# EAGLE board master-v1.1 (EAGLE 6.2)
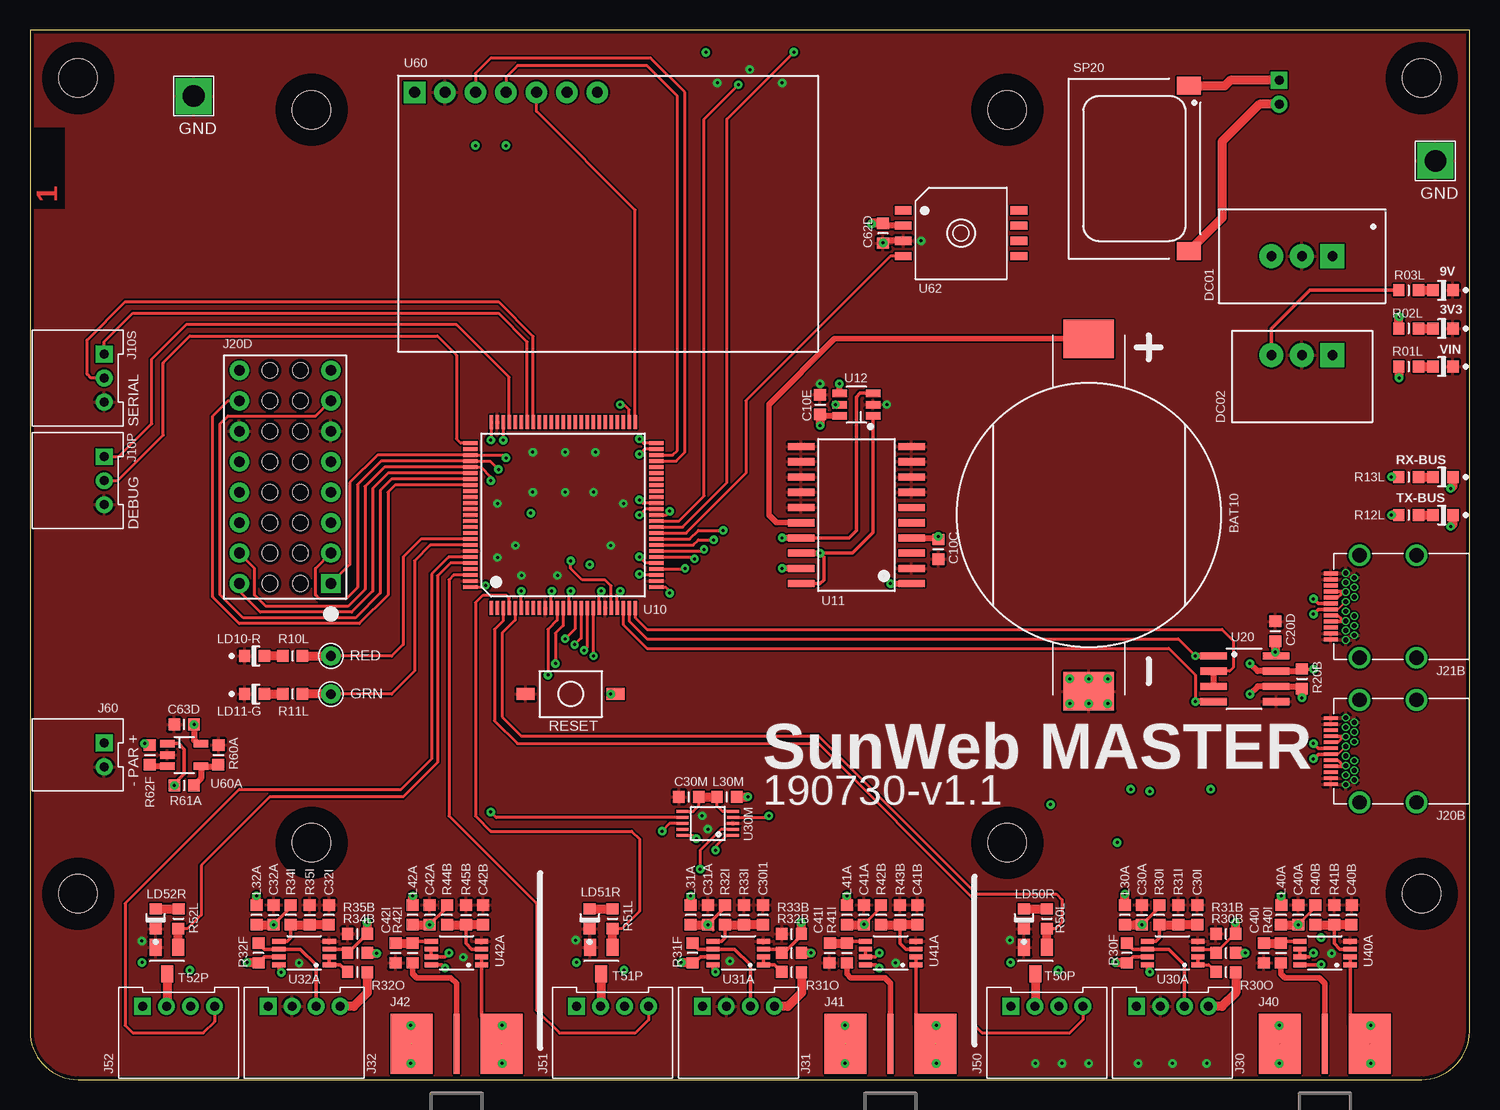
[diagram p7: board, top side]
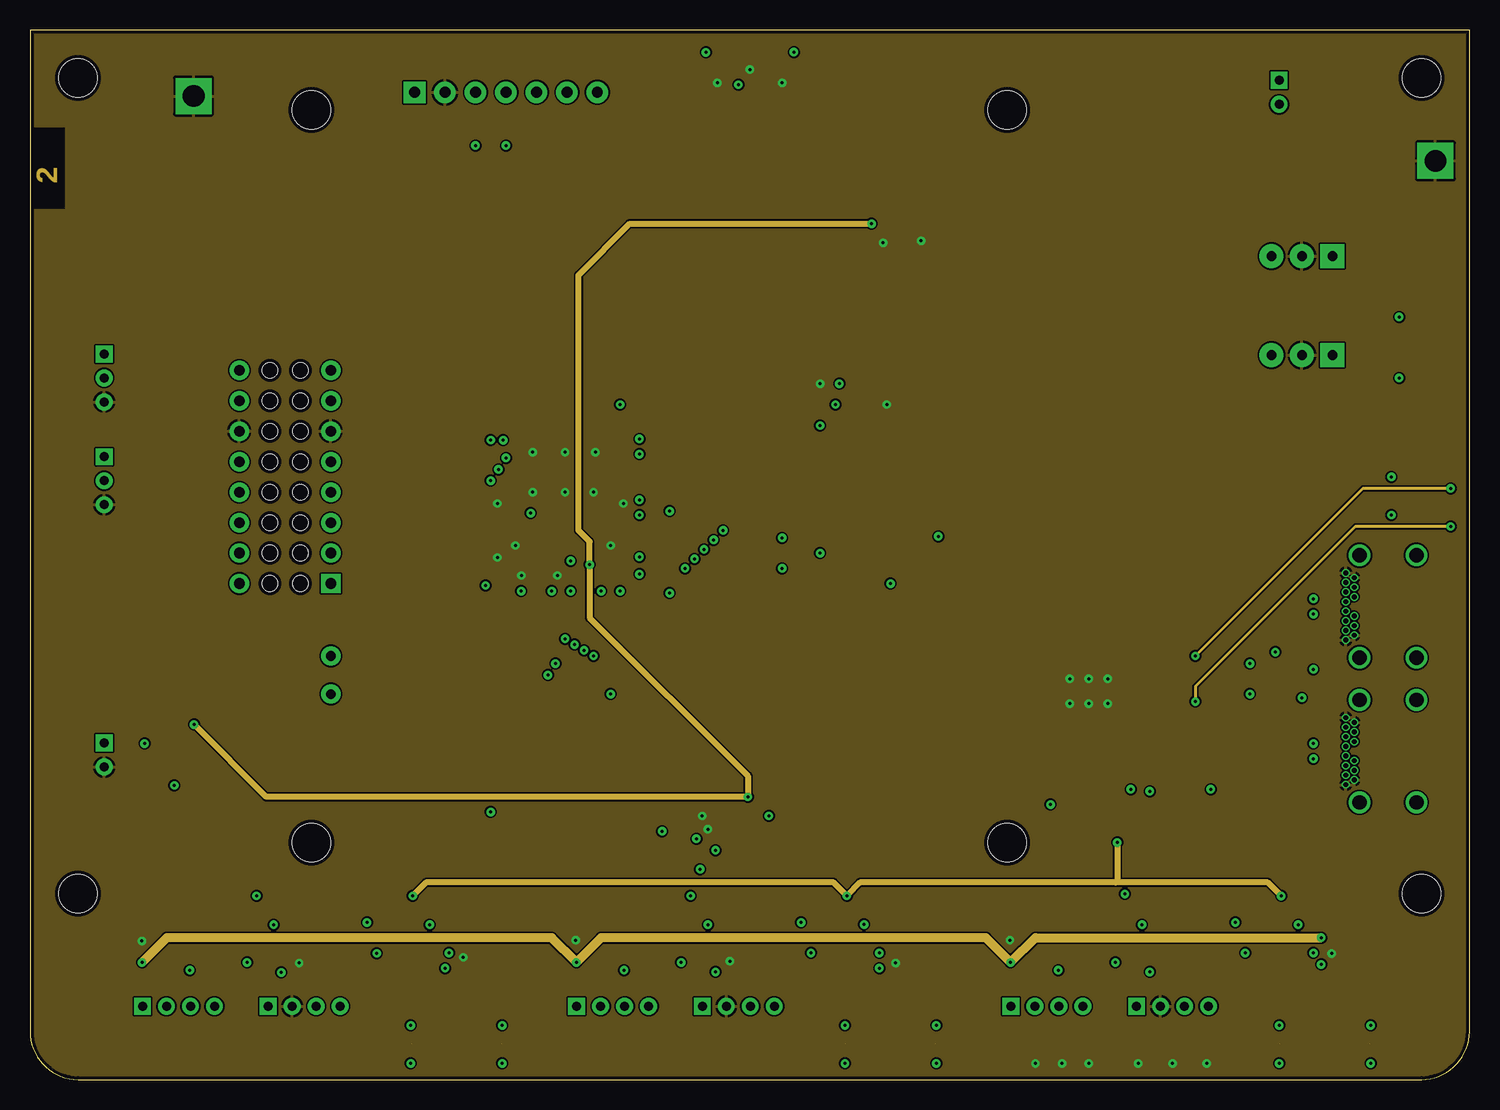
[diagram p8: board, inner layer Route2]
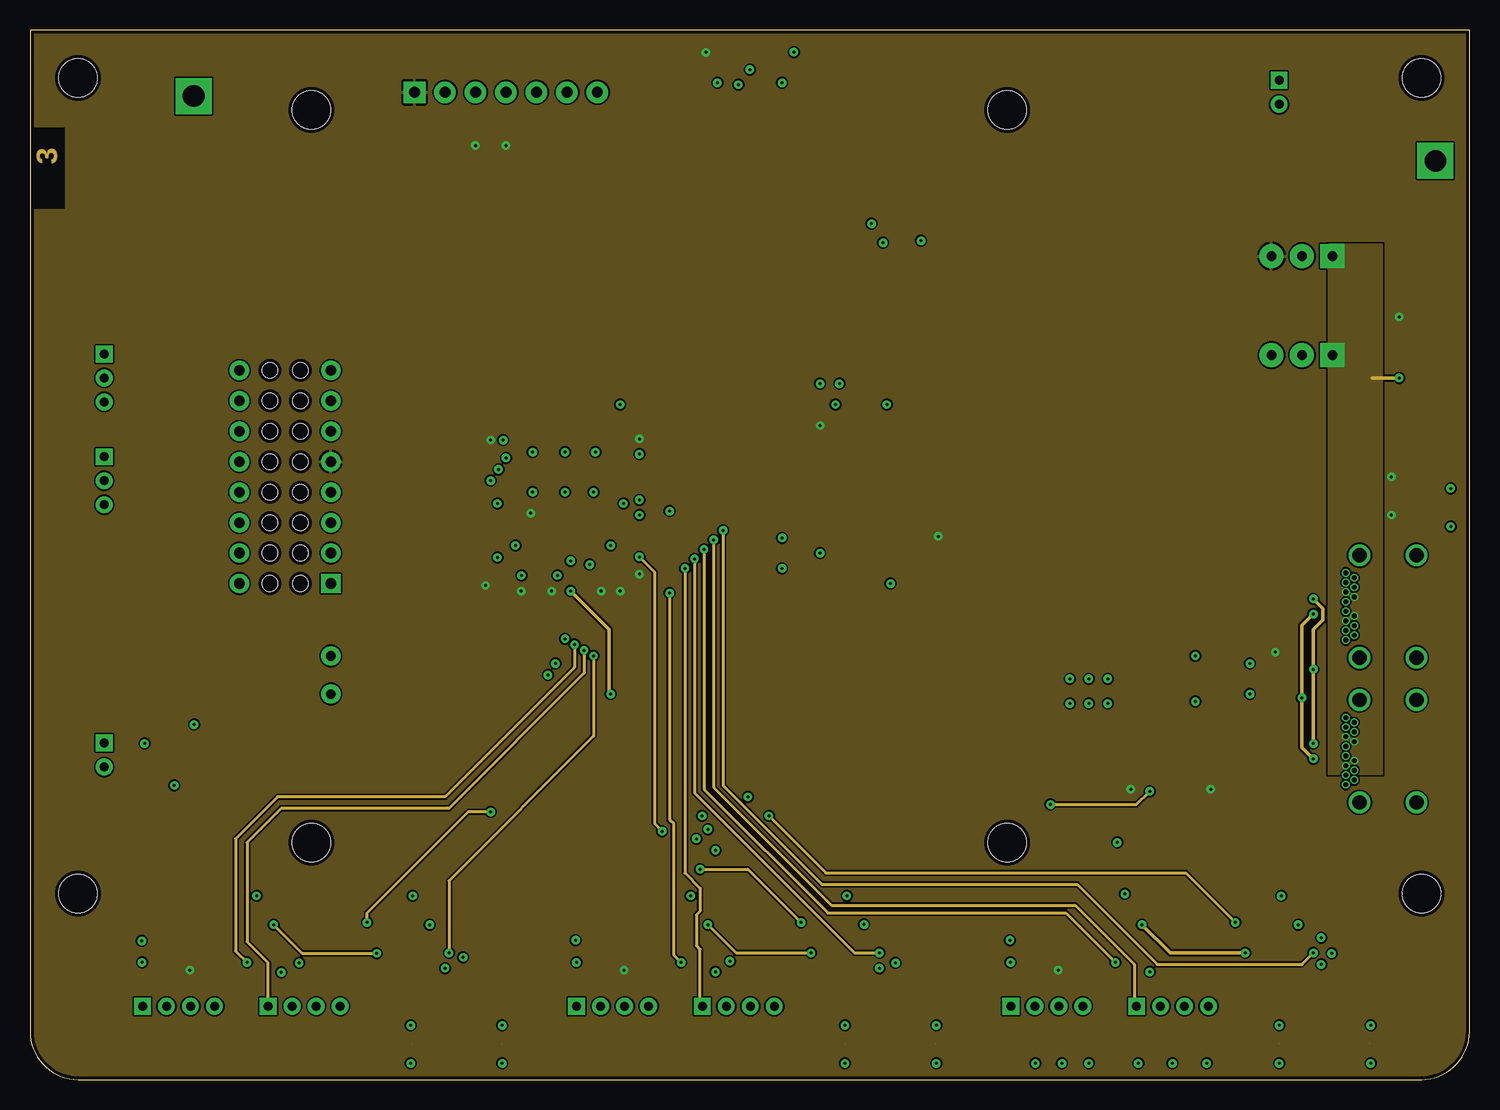
[diagram p9: board, inner layer Route15]
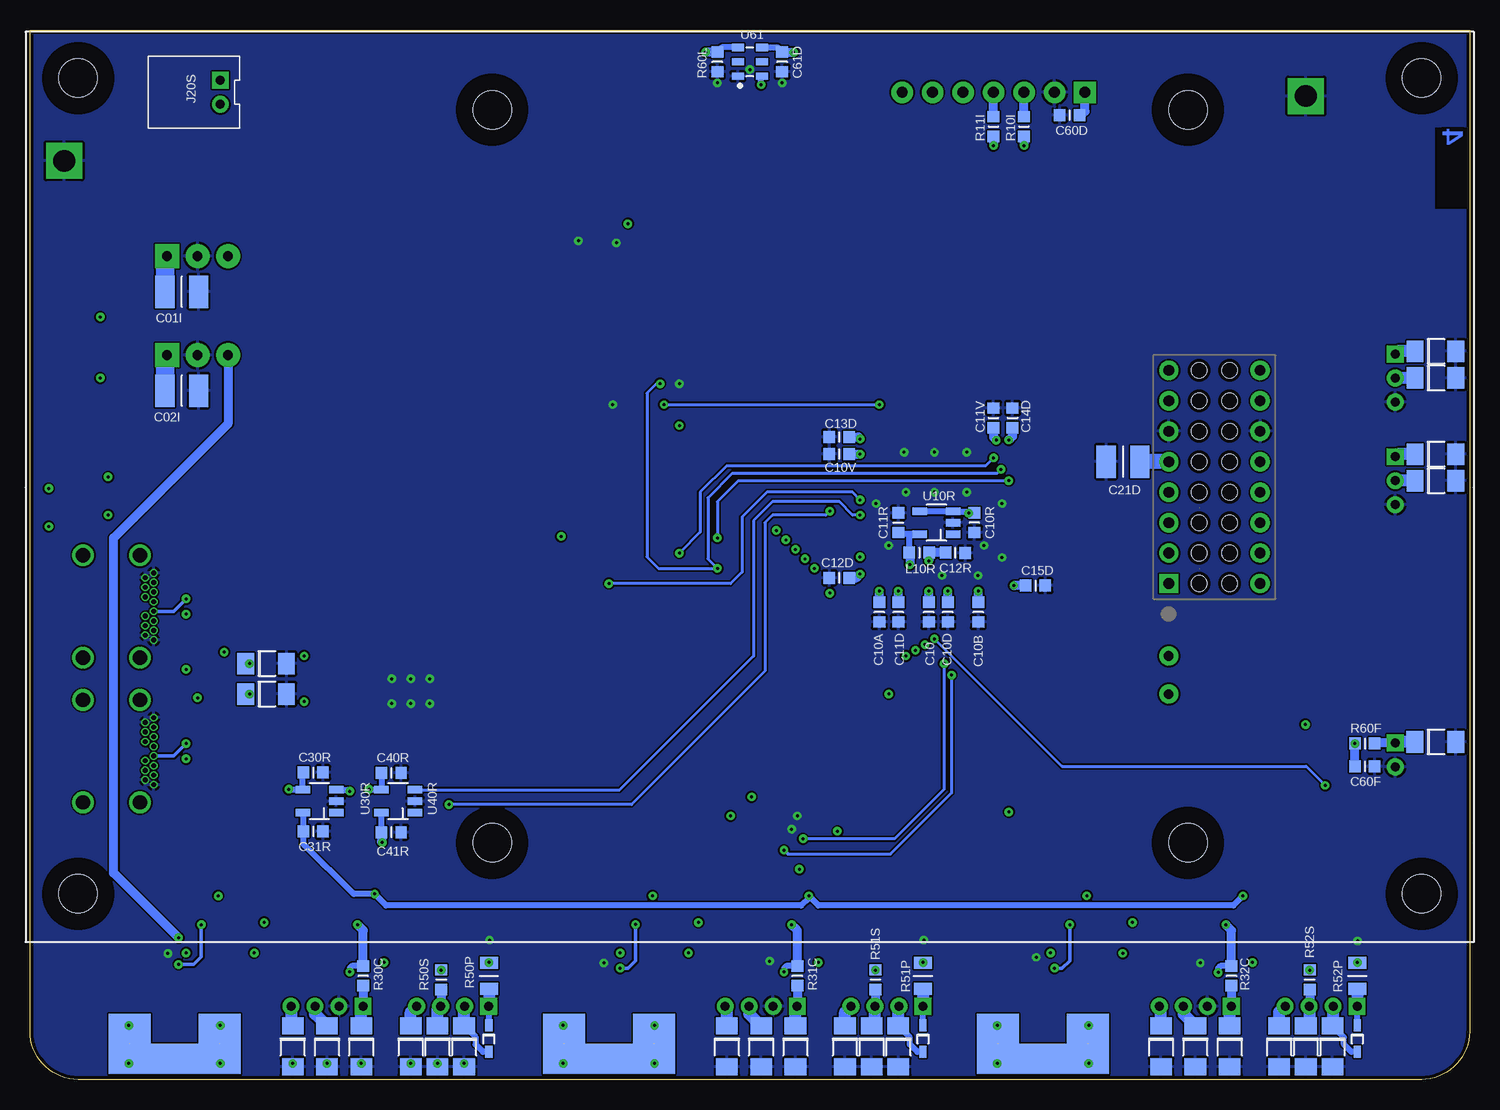
[diagram p10: board, bottom side, seen from below]

Size 120 x 87.5 mm. Coordinates in mm from the lower left corner, seen from the top.
Outline: 120,4 120,87.5 0,87.5 0,4 arc90 4,0 116,0 arc90 120,4
Copper layers (1*2*15*16): Top 0.018mm / dielectric 0.36mm / Route2 0.035mm / dielectric 0.71mm / Route15 0.035mm / dielectric 0.2mm / Bottom 0.018mm
Design rules: minimum track width 0.15mm, minimum drill 0.25mm, track to track 0.15mm, track to pad 0.15mm, pad to pad 0.15mm, via to via 0.15mm, smd to smd 0mil, copper to edge 0.3mm, drill to drill 0.3mm, minimum pad ring 0.125mm, minimum via ring 0.2mm, stop-mask expansion 0.1mm, vias tented up to drill 0.4mm, thermal gap 0.2mm

## Footprints (pad centres in the part's own frame; a part is rotated, then mirrored left to right if it is on the bottom)
LED_SMD_0603 = smd 0.95 x 1: A -0.827,0; C 0.827,0
BU2032SM-BT-GTR = smd 3.2 x 4.2: 1.+ -14.7,0; 2.- 14.7,0
CAP1210 = smd 1.6 x 2.7: 1 -1.4,0; 2 1.4,0
CAP0603 = smd 0.95 x 1: 1 -0.821,0.002; 2 0.822,0
DIODE_SOD323 = smd 1 x 0.6: 1- -1.1,0; 2 1.1,0
TSR2-2433 = drill 0.8 pad 2 square: 1 -2.54,0 | drill 0.8 pad 2: 2 0,0; 3 2.54,0
TSR1-2490 = drill 0.8 pad 2 square: 1 -2.54,0 | drill 0.8 pad 2: 2 0,0; 3 2.54,0
HOLE_PTH_0.8MM = drill 0.8 pad 1.6: 1 0,0
HOLE_NPTH_3.2MM = hole 3.2: 0,0
CON_JST_S3B-PH-K-S = drill 0.75 pad 1.4 square: 1 -2,0 | drill 0.75 pad 1.4: 2 0,0; 3 2,0
CON_USB-C_RECEPTABLE_THT-SMD = smd 0.3 x 1.2: A1 -2.75,1.25; A2 -2.25,1.25; A3 -1.75,1.25; A4 -1.25,1.25; A5 -0.75,1.25; A6 -0.25,1.25; A7 0.25,1.25; A8 0.75,1.25; A9 1.25,1.25; A10 1.75,1.25; A11 2.25,1.25; A12 2.75,1.25 | drill 0.4 pad 0.65: B1 2.8,0; B2 2.4,-0.7; B3 1.6,-0.7; B4 1.2,0; B5 0.8,-0.7; B6 0.4,0; B7 -0.4,0; B8 -0.8,-0.7; B9 -1.2,0; B10 -1.6,-0.7; B11 -2.4,-0.7; B12 -2.8,0; BG1 2,0; BG2 -2,0 | drill 1.2 pad 1.8: C1 -4.27,-5.88; C2 4.27,-5.88; C3 -4.27,-1.15; C4 4.27,-1.15
ME813A-WH50C = drill 0.9 pad 1.6 square: 1 0,0 | drill 0.9 pad 1.6: 2 7.62,0; 3 0,2.54; 4 7.62,2.54; 5 0,5.08; 6 7.62,5.08; 7 0,7.62; 8 7.62,7.62; 9 0,10.16; 10 7.62,10.16; 11 0,12.7; 12 7.62,12.7; 13 0,15.24; 14 7.62,15.24; 15 0,17.78; 16 7.62,17.78 | hole 3.2: -56.39,39.5; 1.61,39.5; -56.39,-21.6; 1.61,-21.6 | hole 1.3: 2.54,17.78; 5.08,17.78; 2.54,15.24; 5.08,15.24; 2.54,12.7; 5.08,12.7; 2.54,10.16; 5.08,10.16; 2.54,7.62; 5.08,7.62; 2.54,5.08; 5.08,5.08; 2.54,2.54; 5.08,2.54; 2.54,0; 5.08,0
CON_JST_S2B-PH-K-S = drill 0.75 pad 1.4 square: 1 -1,0 | drill 0.75 pad 1.4: 2 1,0
CON_JST_S4B-PH-K-S = drill 0.75 pad 1.4 square: 1 -3,0 | drill 0.75 pad 1.4: 2 -1,0; 3 1,0; 4 3,0
SMA_LAUNCH_WIDE_4LAYER_CPW = smd 5 x 3.5: GND1 2.75,3.75; GND2 2.75,-3.75 | smd 2.5 x 4 bottom: GND3 1.5,0 | smd 5 x 3.5 bottom: GND4 2.75,3.75; GND5 2.75,-3.75 | smd 5 x 0.5: PIN 2.75,0
L_0603 = smd 0.95 x 1: 1 -0.821,0.002; 2 0.822,0
RES0603 = smd 0.95 x 1: 1 -0.821,0.002; 2 0.822,0
RES0805 = smd 1 x 1.5: 1 -1.1,0; 2 1.1,0
SWITCH_SMD_PBUTTON_2P = smd 1.5 x 1: 1 -3.75,0; 2 3.75,0
CMS-15118E-SP = smd 1.5 x 2: + 6.9,-4.549; - -6.9,-4.55
NFET_SOT23 = smd 1 x 1.4: 1 -0.95,-1.1; 2 0.95,-1.1; 3 0,1.1
HOLE_PTH_1.8MM_SQR = drill 1.8 pad 3 square: 1 0,0
LQFP100 = smd 0.3 x 1.2: 1 -6,-7.75; 2 -5.5,-7.75; 3 -5,-7.75; 4 -4.5,-7.75; 5 -4,-7.75; 6 -3.5,-7.75; 7 -3,-7.75; 8 -2.5,-7.75; 9 -2,-7.75; 10 -1.5,-7.75; 11 -1,-7.75; 12 -0.5,-7.75; 13 0,-7.75; 14 0.5,-7.75; 15 1,-7.75; 16 1.5,-7.75; 17 2,-7.75; 18 2.5,-7.75; 19 3,-7.75; 20 3.5,-7.75; 21 4,-7.75; 22 4.5,-7.75; 23 5,-7.75; 24 5.5,-7.75; 25 6,-7.75; 51 6,7.75; 52 5.5,7.75; 53 5,7.75; 54 4.5,7.75; 55 4,7.75; 56 3.5,7.75; 57 3,7.75; 58 2.5,7.75; 59 2,7.75; 60 1.5,7.75; 61 1,7.75; 62 0.5,7.75; 63 0,7.75; 64 -0.5,7.75; 65 -1,7.75; 66 -1.5,7.75; 67 -2,7.75; 68 -2.5,7.75; 69 -3,7.75; 70 -3.5,7.75; 71 -4,7.75; 72 -4.5,7.75; 73 -5,7.75; 74 -5.5,7.75; 75 -6,7.75 | smd 1.2 x 0.3: 26 7.75,-6; 27 7.75,-5.5; 28 7.75,-5; 29 7.75,-4.5; 30 7.75,-4; 31 7.75,-3.5; 32 7.75,-3; 33 7.75,-2.5; 34 7.75,-2; 35 7.75,-1.5; 36 7.75,-1; 37 7.75,-0.5; 38 7.75,0; 39 7.75,0.5; 40 7.75,1; 41 7.75,1.5; 42 7.75,2; 43 7.75,2.5; 44 7.75,3; 45 7.75,3.5; 46 7.75,4; 47 7.75,4.5; 48 7.75,5; 49 7.75,5.5; 50 7.75,6; 76 -7.75,6; 77 -7.75,5.5; 78 -7.75,5; 79 -7.75,4.5; 80 -7.75,4; 81 -7.75,3.5; 82 -7.75,3; 83 -7.75,2.5; 84 -7.75,2; 85 -7.75,1.5; 86 -7.75,1; 87 -7.75,0.5; 88 -7.75,0; 89 -7.75,-0.5; 90 -7.75,-1; 91 -7.75,-1.5; 92 -7.75,-2; 93 -7.75,-2.5; 94 -7.75,-3; 95 -7.75,-3.5; 96 -7.75,-4; 97 -7.75,-4.5; 98 -7.75,-5; 99 -7.75,-5.5; 100 -7.75,-6
SOT23-5 = smd 0.62 x 1.22: 1 -0.95,-1.4; 2 0,-1.4; 3 0.95,-1.4; 4 0.95,1.4; 5 -0.95,1.4
SO20W = smd 0.6 x 2.2: 1 -5.715,-4.6; 2 -4.445,-4.6; 3 -3.175,-4.6; 4 -1.905,-4.6; 5 -0.635,-4.6; 6 0.635,-4.6; 7 1.905,-4.6; 8 3.175,-4.6; 9 4.445,-4.6; 10 5.715,-4.6; 11 5.715,4.6; 12 4.445,4.6; 13 3.175,4.6; 14 1.905,4.6; 15 0.635,4.6; 16 -0.635,4.6; 17 -1.905,4.6; 18 -3.175,4.6; 19 -4.445,4.6; 20 -5.715,4.6
SOT23-6 = smd 0.62 x 1.22: 1 -0.95,-1.4; 2 0,-1.4; 3 0.95,-1.4; 4 0.95,1.4; 5 0,1.4; 6 -0.95,1.4
SO8 = smd 0.6 x 2.2: 1 -1.905,-2.6; 2 -0.635,-2.6; 3 0.635,-2.6; 4 1.905,-2.6; 5 1.905,2.6; 6 0.635,2.6; 7 -0.635,2.6; 8 -1.905,2.6
MSOP8 = smd 0.4 x 1.1: 1 -0.975,-2.1; 2 -0.325,-2.1; 3 0.325,-2.1; 4 0.975,-2.1; 5 0.975,2.1; 6 0.325,2.1; 7 -0.325,2.1; 8 -0.975,2.1
MSOP10 = smd 0.25 x 1: 1 -1,-2.113; 2 -0.5,-2.113; 3 0,-2.113; 4 0.5,-2.113; 5 1,-2.113; 6 1,2.113; 7 0.5,2.113; 8 0,2.113; 9 -0.5,2.113; 10 -1,2.113
SCD30 = drill 0.9 pad 1.8 square: 1 0,0 | drill 0.9 pad 1.8: 2 2.54,0; 3 5.08,0; 4 7.62,0; 5 10.16,0; 6 12.7,0; 7 15.24,0
APDS-9007 = smd 0.6 x 1: 1 -1.2,1; 2 0,1; 3 1.2,1; 4 1.2,-1; 5 0,-1; 6 -1.2,-1
MP3H6115A = smd 0.7 x 1.4: 1 -1.905,-4.826; 2 -0.635,-4.826; 3 0.635,-4.826; 4 1.905,-4.826; 5 1.905,4.826; 6 0.635,4.826; 7 -0.635,4.826; 8 -1.905,4.826
ZENER_SOD80 = smd 1.4 x 1.8: 1 -1.7,0; 2 1.7,0

## Placement (x,y rotation side)
3V3  GRN  [LED_SMD_0603]  117.78,62.62 0 top
9V  GRN  [LED_SMD_0603]  117.78,65.79 0 top
BAT10  BU2032SM-BT-GTR  [BU2032SM-BT-GTR]  88.26,47.06 270 top
C01I  10U/50V  [CAP1210]  107.35,65.68 0 bottom
C02I  10U/50V  [CAP1210]  107.35,57.42 0 bottom
C10  100N  [CAP0603]  45.08,38.96 270 bottom
C10A  10N  [CAP0603]  49.2,38.96 270 bottom
C10B  100N  [CAP0603]  40.95,38.96 270 bottom
C10C  100N  [CAP0603]  75.72,44.2 270 top
C10D  10N  [CAP0603]  43.49,38.96 270 bottom
C10E  100N  [CAP0603]  65.87,56.27 90 top
C10R  1U  [CAP0603]  41.27,46.42 270 bottom
C10V  2U2  [CAP0603]  52.54,52.14 180 bottom
C11D  10N  [CAP0603]  47.62,38.96 270 bottom
C11R  10N  [CAP0603]  47.62,46.42 90 bottom
C11V  2U2  [CAP0603]  39.68,55.16 90 bottom
C12D  10N  [CAP0603]  52.54,41.82 180 bottom
C12R  1U  [CAP0603]  42.86,43.92 180 bottom
C13D  10N  [CAP0603]  52.54,53.57 180 bottom
C14D  10N  [CAP0603]  38.09,55.16 90 bottom
C15D  10N  [CAP0603]  36.19,41.17 0 bottom
C20D  10N  [CAP0603]  103.81,37.38 90 top
C21D  NOPOP  [CAP1210]  28.89,51.51 180 bottom
C30A  100N  [CAP0603]  92.7,13.72 90 top
C30I  100N  [CAP0603]  97.31,13.72 270 top
C30I1  100N  [CAP0603]  61.11,13.72 270 top
C30M  100N  [CAP0603]  54.92,23.56 180 top
C30R  1U  [CAP0603]  96.39,25.59 0 bottom
C31A  100N  [CAP0603]  56.51,13.72 90 top
C31R  10N  [CAP0603]  96.39,20.68 0 bottom
C32A  100N  [CAP0603]  20.31,13.72 90 top
C32I  100N  [CAP0603]  24.92,13.72 270 top
C40A  100N  [CAP0603]  105.72,13.72 270 top
C40B  100N  [CAP0603]  110.16,13.72 270 top
C40I  10N  [CAP0603]  102.86,10.55 90 top
C40R  1U  [CAP0603]  89.89,25.55 0 bottom
C41A  100N  [CAP0603]  69.53,13.72 270 top
C41B  100N  [CAP0603]  73.97,13.72 270 top
C41I  10N  [CAP0603]  66.67,10.55 90 top
C41R  10N  [CAP0603]  89.89,20.62 0 bottom
C42A  100N  [CAP0603]  33.33,13.72 270 top
C42B  100N  [CAP0603]  37.77,13.72 270 top
C42I  10N  [CAP0603]  30.47,10.55 90 top
C60D  100N  [CAP0603]  33.33,80.4 180 bottom
C60F  1U  [CAP0603]  8.72,26.11 0 bottom
C61D  100N  [CAP0603]  57.3,84.84 270 bottom
C62D  100N  [CAP0603]  71.11,70.56 270 top
C63D  100N  [CAP0603]  12.85,29.6 180 top
D50  DUS  [DIODE_SOD323]  81.75,3.4 270 bottom
D51  DUS  [DIODE_SOD323]  45.55,3.4 270 bottom
D52  DUS  [DIODE_SOD323]  9.36,3.4 270 bottom
DC01  TSR2-2433  [TSR2-2433]  106.04,68.65 180 top
DC02  TSR1-2490  [TSR1-2490]  106.04,60.4 180 top
GRN  PIN_TEST  [HOLE_PTH_0.8MM]  25.08,32.14 0 top
H1  HOLE_NPTH_3.2MM  [HOLE_NPTH_3.2MM]  4,83.5 0 top
H2  HOLE_NPTH_3.2MM  [HOLE_NPTH_3.2MM]  116,83.5 0 top
H3  HOLE_NPTH_3.2MM  [HOLE_NPTH_3.2MM]  116,15.5 0 top
H4  HOLE_NPTH_3.2MM  [HOLE_NPTH_3.2MM]  4,15.5 0 top
J10P  CON_JST_S3B-PH-K-S  [CON_JST_S3B-PH-K-S]  6.18,49.92 270 top
J10S  CON_JST_S3B-PH-K-S  [CON_JST_S3B-PH-K-S]  6.18,58.49 270 top
J20B  CON_USB-C_RECEPTABLE_THT-SMD  [CON_USB-C_RECEPTABLE_THT-SMD]  109.69,27.38 90 top
J20D  ME813A-WH50C  [ME813A-WH50C]  25.08,41.34 0 bottom
J20S  CON_JST_S2B-PH-K-S  [CON_JST_S2B-PH-K-S]  104.13,82.3 270 bottom
J21B  CON_USB-C_RECEPTABLE_THT-SMD  [CON_USB-C_RECEPTABLE_THT-SMD]  109.69,39.44 90 top
J30  CON_JST_S4B-PH-K-S  [CON_JST_S4B-PH-K-S]  95.24,6.1 0 top
J31  CON_JST_S4B-PH-K-S  [CON_JST_S4B-PH-K-S]  59.05,6.1 0 top
J32  CON_JST_S4B-PH-K-S  [CON_JST_S4B-PH-K-S]  22.85,6.1 0 top
J40  [SMA_LAUNCH_WIDE_4LAYER_CPW]  107.94,0.23 90 top
J41  [SMA_LAUNCH_WIDE_4LAYER_CPW]  71.75,0.23 90 top
J42  [SMA_LAUNCH_WIDE_4LAYER_CPW]  35.55,0.23 90 top
J50  CON_JST_S4B-PH-K-S  [CON_JST_S4B-PH-K-S]  84.77,6.1 0 top
J51  CON_JST_S4B-PH-K-S  [CON_JST_S4B-PH-K-S]  48.57,6.1 0 top
J52  CON_JST_S4B-PH-K-S  [CON_JST_S4B-PH-K-S]  12.38,6.1 0 top
J60  CON_JST_S2B-PH-K-S  [CON_JST_S2B-PH-K-S]  6.18,27.06 270 top
L10R  742792695  [L_0603]  45.87,43.92 0 bottom
L30A  742792695  [L_0603]  91.27,13.72 270 top
L30M  742792695  [L_0603]  58.09,23.56 180 top
L31A  742792695  [L_0603]  55.08,13.72 270 top
L32A  742792695  [L_0603]  18.88,13.72 270 top
L40A  742792695  [L_0603]  104.29,13.72 270 top
L41A  742792695  [L_0603]  68.1,13.72 270 top
L42A  742792695  [L_0603]  31.9,13.72 270 top
LD10-R  RED  [LED_SMD_0603]  18.73,35.31 180 top
LD11-G  GRN  [LED_SMD_0603]  18.73,32.14 180 top
LD50R  RED  [LED_SMD_0603]  82.86,13.4 270 top
LD51R  RED  [LED_SMD_0603]  46.66,13.4 270 top
LD52R  RED  [LED_SMD_0603]  10.47,13.4 270 top
R01L  430K  [RES0603]  114.93,59.44 0 top
R02L  22K  [RES0603]  114.93,62.62 0 top
R03L  130K  [RES0603]  114.93,65.79 0 top
R10I  1K  [RES0603]  37.14,79.44 90 bottom
R10L  1K  [RES0603]  21.9,35.31 180 top
R11I  1K  [RES0603]  39.68,79.44 90 bottom
R11L  1K  [RES0603]  21.9,32.14 180 top
R12L  1K  [RES0603]  114.93,47.06 0 top
R13L  1K  [RES0603]  114.93,50.23 0 top
R20B  120R  [RES0603]  106.04,33.41 90 top
R30B  10K/0.1%  [RES0603]  99.69,10.55 180 top
R30C  10K/0.1%  [RES0603]  92.23,8.64 270 bottom
R30F  500R(TBD)/0.1%  [RES0603]  91.43,10.55 270 top
R30I  10K/0.1%  [RES0603]  94.13,13.72 270 top
R30O  0R  [RES0603]  99.69,8.96 180 top
R31B  10K/0.1%  [RES0603]  99.69,12.13 180 top
R31C  10K/0.1%  [RES0603]  56.03,8.64 270 bottom
R31F  500R(TBD)/0.1%  [RES0603]  55.24,10.55 270 top
R31I  10K/0.1%  [RES0603]  95.72,13.72 90 top
R31O  0R  [RES0603]  63.49,8.96 180 top
R32B  10K/0.1%  [RES0603]  63.49,10.55 180 top
R32C  10K/0.1%  [RES0603]  19.84,8.64 270 bottom
R32F  500R(TBD)/0.1%  [RES0603]  19.04,10.55 270 top
R32I  10K/0.1%  [RES0603]  57.94,13.72 270 top
R32O  0R  [RES0603]  27.3,8.96 180 top
R33B  10K/0.1%  [RES0603]  63.49,12.13 180 top
R33I  10K/0.1%  [RES0603]  59.52,13.72 90 top
R34B  10K/0.1%  [RES0603]  27.3,10.55 180 top
R34I  10K/0.1%  [RES0603]  21.74,13.72 270 top
R35B  10K/0.1%  [RES0603]  27.3,12.13 180 top
R35I  10K/0.1%  [RES0603]  23.33,13.72 90 top
R40B  10K/0.1%  [RES0603]  107.15,13.72 270 top
R40I  1M  [RES0603]  104.29,10.55 90 top
R41B  10K/0.1%  [RES0603]  108.74,13.72 90 top
R41I  1M  [RES0603]  68.1,10.55 90 top
R42B  10K/0.1%  [RES0603]  70.95,13.72 270 top
R42I  1M  [RES0603]  31.9,10.55 90 top
R43B  10K/0.1%  [RES0603]  72.54,13.72 90 top
R44B  10K/0.1%  [RES0603]  34.76,13.72 270 top
R45B  10K/0.1%  [RES0603]  36.35,13.72 90 top
R50L  1K  [RES0603]  84.77,13.4 90 top
R50P  10R  [RES0805]  81.75,8.64 270 bottom
R50S  10K  [RES0603]  85.72,8.32 270 bottom
R51L  1K  [RES0603]  48.57,13.4 90 top
R51P  10R  [RES0805]  45.55,8.64 270 bottom
R51S  10K  [RES0603]  49.52,8.32 270 bottom
R52L  1K  [RES0603]  12.38,13.4 90 top
R52P  10R  [RES0805]  9.36,8.64 270 bottom
R52S  10K  [RES0603]  13.33,8.32 270 bottom
R60A  1K/0.1%  [RES0603]  15.71,27.06 90 top
R60F  10K  [RES0603]  8.72,28.01 0 bottom
R60L  220K  [RES0603]  62.7,84.84 270 bottom
R61A  99K/0.1%  [RES0603]  12.85,24.52 0 top
R62F  1K/0.1%  [RES0603]  9.99,27.06 90 top
RED  PIN_TEST  [HOLE_PTH_0.8MM]  25.08,35.31 0 top
RESET  MCTAEF-25R-V  [SWITCH_SMD_PBUTTON_2P]  45.08,32.14 0 top
RX-BUS  GRN  [LED_SMD_0603]  117.78,50.23 0 top
SP20  CMS-15118E-SP  [CMS-15118E-SP]  92.07,75.95 90 top
T50P  Si2318CDS  [NFET_SOT23]  83.81,9.91 180 top
T51P  Si2318CDS  [NFET_SOT23]  47.62,9.91 180 top
T52P  Si2318CDS  [NFET_SOT23]  11.42,9.91 180 top
TP1  [HOLE_PTH_1.8MM_SQR]  117.15,76.59 0 top
TP2  [HOLE_PTH_1.8MM_SQR]  13.65,81.98 0 top
TX-BUS  RED  [LED_SMD_0603]  117.78,47.06 0 top
U10  STM32F407VG  [LQFP100]  44.44,47.06 0 top
U10R  LM4120AIM5-3.0  [SOT23-5]  44.44,46.42 90 bottom
U11  DS3234  [SO20W]  68.89,47.06 90 top
U12  25AA040ASO  [SOT23-6]  68.89,56.27 90 top
U20  ADM3485ARZ  [SO8]  101.28,33.41 270 top
U30A  AD8606ARMZ  [MSOP8]  95.24,10.55 90 top
U30M  ADG804  [MSOP10]  56.51,21.34 90 top
U30R  LM4120AIM5-3.0  [SOT23-5]  95.87,23.21 90 bottom
U31A  AD8606ARMZ  [MSOP8]  59.05,10.55 90 top
U32A  AD8606ARMZ  [MSOP8]  22.85,10.55 90 top
U40A  AD8606ARMZ  [MSOP8]  107.94,10.55 90 top
U40R  LM4120AIM5-3.0  [SOT23-5]  89.31,23.21 90 bottom
U41A  AD8606ARMZ  [MSOP8]  71.75,10.55 90 top
U42A  AD8606ARMZ  [MSOP8]  35.55,10.55 90 top
U60  SCD30  [SCD30]  32.06,82.3 0 top
U60A  AD8605ARTZ  [SOT23-5]  12.85,27.06 270 top
U61  APDS-9007  [APDS-9007]  60,84.84 90 bottom
U62  MP3H6115A  [MP3H6115A]  77.62,70.56 270 top
VIN  GRN  [LED_SMD_0603]  117.78,59.44 0 top
Z10P  3V3  [ZENER_SOD80]  2.85,52.14 180 bottom
Z10S  3V3  [ZENER_SOD80]  2.85,58.49 180 bottom
Z10U  3V3  [ZENER_SOD80]  100.32,34.68 180 bottom
Z11S  3V3  [ZENER_SOD80]  2.85,60.71 180 bottom
Z11U  3V3  [ZENER_SOD80]  100.32,32.14 180 bottom
Z30  3V3  [ZENER_SOD80]  92.38,2.77 90 bottom
Z31  3V3  [ZENER_SOD80]  95.24,2.77 90 bottom
Z32  3V3  [ZENER_SOD80]  98.1,2.77 90 bottom
Z33  3V3  [ZENER_SOD80]  56.19,2.77 90 bottom
Z34  3V3  [ZENER_SOD80]  59.05,2.77 90 bottom
Z35  3V3  [ZENER_SOD80]  61.91,2.77 90 bottom
Z36  3V3  [ZENER_SOD80]  19.99,2.77 90 bottom
Z37  3V3  [ZENER_SOD80]  22.85,2.77 90 bottom
Z38  3V3  [ZENER_SOD80]  25.71,2.77 90 bottom
Z50  3V3  [ZENER_SOD80]  86.03,2.77 90 bottom
Z51  3V3  [ZENER_SOD80]  88.26,2.77 90 bottom
Z52  12V  [ZENER_SOD80]  83.81,2.77 90 bottom
Z53  3V3  [ZENER_SOD80]  49.84,2.77 90 bottom
Z54  3V3  [ZENER_SOD80]  52.06,2.77 90 bottom
Z55  12V  [ZENER_SOD80]  47.62,2.77 90 bottom
Z56  3V3  [ZENER_SOD80]  13.65,2.77 90 bottom
Z57  3V3  [ZENER_SOD80]  15.87,2.77 90 bottom
Z58  12V  [ZENER_SOD80]  11.42,2.77 90 bottom
Z60  3V3  [ZENER_SOD80]  2.86,28.15 180 bottom
Z112P  3V3  [ZENER_SOD80]  2.85,49.92 180 bottom

## Tracks (layer width: path | path; a pad name or v marks a point on that pad's centre or on a via)
!EE_SEL  (via drill 0.25 pad 0.7)
  Top 0.254: U12.5 v67.14,56.27 | U10.52 49.94,55.85 49.52,56.27 v49.2,56.27
  Bottom 0.254: v67.14,56.27 v49.2,56.27
!PH0_OFF
  Top 0.305: U40A.3 109.2,10.87 108.73,11.34 108.73,12.77 R41B.1
  Top 0.762: R40B.2 108.6,12.9 108.73,12.77 108.87,12.9 C40B.2
!PH1_OFF
  Top 0.305: U41A.3 73.01,10.87 72.54,11.34 R43B.1
  Top 0.762: R42B.2 R43B.1 C41B.2
!PH2_OFF
  Top 0.305: U42A.3 36.81,10.87 36.34,11.34 R45B.1
  Top 0.762: R44B.2 R45B.1 C42B.2
!RST  (via drill 0.25 pad 0.7)
  Top 0.254: U10.14 44.94,40.58 v45.08,40.71
  Top 0.762: RESET.2 v48.41,32.14
  Route15 0.305: v45.08,40.71 48.25,37.53 48.25,32.3 v48.41,32.14
  Bottom 0.762: C10.1 v45.08,40.71
!RTC_SEL  (via drill 0.25 pad 0.7)
  Top 0.254: U10.40 51.06,48.06 v50.79,48.33
  Top 0.508: v71.75,41.34 U11.1
  Bottom 0.254: v71.75,41.34 61.59,41.34 60.63,42.3 60.63,46.9 58.57,48.97 51.43,48.97 v50.79,48.33
!TFT_INT
  Top 0.254: U10.83 30.43,49.56 29.84,48.97 29.84,40.39 27.46,38.01 17.45,38.01 15.23,40.23 15.23,55.31 16.5,56.59 J20D.14
!TFT_PD
  Top 0.254: U10.82 30.14,50.06 29.2,49.12 29.2,40.55 27.14,38.49 17.77,38.49 15.87,40.39 15.87,54.68 16.5,55.31 23.8,55.31 J20D.13
!TFT_SEL
  Top 0.254: U10.81 29.84,50.56 28.57,49.28 28.57,40.71 26.82,38.96 19.2,38.96 17.45,40.71 J20D.2
BUS_A  (via drill 0.25 pad 0.7)
  Top 0.152: J21B.A6 109.04,39.19 J21B.B6 | J20B.A6 109.04,27.12 J20B.B6
  Top 0.305: J21B.A6 107.38,39.19 v106.99,38.8 | J20B.A6 107.38,27.12 v106.99,26.74
  Top 0.508: v101.7,32.14 102.34,32.77 U20.6 105.85,32.77 R20B.1
  Top 0.762: R20B.1 v106.03,31.82 v106.04,31.82
  Route15 0.305: v106.99,38.8 106.04,37.85 v106.04,31.82 106.04,27.69 v106.99,26.74
  Bottom 0.762: v101.7,32.14 Z11U.2
BUS_B  (via drill 0.25 pad 0.7)
  Top 0.305: J21B.A7 107.38,39.69 v106.99,40.08 | J20B.A7 107.38,27.62 v106.99,28.01 | v106.99,34.2 106.01,34.2 105.94,34.14
  Top 0.508: v101.7,34.68 102.34,34.04 U20.7 105.85,34.04 105.94,34.14 R20B.2
  Route15 0.305: v106.99,28.01 v106.99,34.2 106.99,37.53 107.78,38.33 107.78,39.28 v106.99,40.08
  Bottom 0.305: J20B.B7 108.03,26.98 v106.99,28.01 | J21B.B7 108.03,39.04 v106.99,40.08
  Bottom 0.762: v101.7,34.68 Z10U.2
CO2_RDY
  Top 0.254: U10.51 50.44,72.49 42.22,80.72 U60.5
DIR_485
  Top 0.254: U10.25 50.44,38.52 51.43,37.53 99.37,37.53 100.32,36.58 100.32,34.36 100,34.04 U20.2
  Top 0.508: U20.3 U20.2
EC0  (via drill 0.25 pad 0.7)
  Top 0.254: U10.32 56.05,44.06 v56.19,44.2
  Top 0.305: 91.59,9.57 R30F.2 91.93,10.22 U30A.7
  Top 0.762: v90.48,9.75 91.4,9.75 R30F.2
  Route15 0.254: v56.19,44.2 56.19,24.2 66.51,13.88 86.35,13.88 v90.48,9.75
EC0_DAC  (via drill 0.25 pad 0.7)
  Top 0.254: 100.45,12.13 R30B.2 98.54,10.87 U30A.3 | U30M.4 61.45,21.84 v61.59,21.98
  Top 0.305: R31B.1 100.45,12.13
  Top 0.762: v100.48,13.09 100.48,12.16 R31B.1
  Route15 0.254: v61.59,21.98 66.35,17.21 96.35,17.21 v100.48,13.09
EC0_IN
  Top 0.305: R30F.1 91.93,10.87 U30A.6 94.92,10.87 96.24,9.55 J30.3
  Bottom 1.016: J30.3 96.24,5.47 Z31.2
EC0_OUT
  Top 0.762: R30O.1 100.51,7.24 99.37,6.1 J30.4
  Bottom 1.016: J30.4 98.24,4.61 Z32.2
EC1  (via drill 0.25 pad 0.7)
  Top 0.254: 55.24,9.57 R31F.2 | U10.26 52.98,41.06 53.33,40.71 v53.33,40.55
  Top 0.305: U31A.7 55.89,10.22 55.24,9.57
  Top 0.762: v54.28,9.75 55.21,9.75 R31F.2
  Route15 0.254: v53.33,40.55 53.33,21.66 53.65,21.34 53.65,10.39 v54.28,9.75
EC1_DAC  (via drill 0.25 pad 0.7)
  Top 0.254: U30M.2 57.59,20.84 55.87,19.12 v55.87,17.53
  Top 0.305: U31A.3 62.34,10.87 R32B.2 62.86,10.55 64.29,11.98 64.29,12.11 R33B.1
  Top 0.762: v64.29,13.09 64.29,12.16 R33B.1
  Route15 0.254: v55.87,17.53 59.84,17.53 v64.29,13.09
EC1_IN
  Top 0.305: R31F.1 55.74,10.87 U31A.6 58.72,10.87 60.05,9.55 J31.3
  Bottom 1.016: J31.3 60.05,5.47 Z34.2
EC1_OUT
  Top 0.762: R31O.1 64.31,7.24 63.17,6.1 J31.4
  Bottom 1.016: Z35.2 61.91,5.96 J31.4
EC2  (via drill 0.25 pad 0.7)
  Top 0.254: 18.91,9.6 R32F.2 | U10.16 45.94,36.81 v45.39,36.27
  Top 0.305: 19.2,9.57 R32F.2 19.54,10.22 U32A.7
  Top 0.762: v18.09,9.75 19.01,9.75 R32F.2
  Route15 0.254: v18.09,9.75 17.14,10.71 17.14,20.07 20.63,23.56 34.6,23.56 45.39,34.36 v45.39,36.27
EC2_DAC  (via drill 0.25 pad 0.7)
  Top 0.254: U30M.7 38.86,21.84 v38.41,22.3
  Top 0.305: U32A.3 26.15,10.87 R34B.2 26.5,10.55 27.93,11.98 27.96,11.98 R35B.1
  Top 0.762: v28.09,13.09 28.09,12.16 R35B.1
  Route15 0.254: v38.41,22.3 36.5,22.3 28.09,13.88 v28.09,13.09
EC2_IN
  Top 0.305: R32F.1 19.54,10.87 U32A.6 22.53,10.87 23.85,9.55 J32.3
  Bottom 1.016: J32.3 23.85,5.47 Z37.2
EC2_OUT
  Top 0.762: R32O.1 28.12,7.24 26.98,6.1 J32.4
  Bottom 1.016: Z38.2 25.71,5.96 J32.4
EC30_BUF
  Top 0.254: U30A.1 98.25,9.57 R30O.2
  Top 0.305: U30A.2 U30A.1
EC30_BUF1
  Top 0.305: U31A.2 U31A.1 62.06,9.57 R31O.2
EC30_BUF2
  Top 0.305: U32A.2 U32A.1 25.86,9.57 R32O.2
EC_DAC  (via drill 0.25 pad 0.7)
  Top 0.254: U30M.8 53.33,21.34 v52.7,20.71 | U10.30 51.3,43.06 v50.79,43.57
  Route15 0.254: v52.7,20.71 52.54,20.87 52.38,21.02 52.06,21.34 52.06,42.3 v50.79,43.57
EC_SEL0  (via drill 0.25 pad 0.7)
  Top 0.254: U10.12 43.94,38.3 43.17,37.53 v43.17,33.73 | U30M.1 58.05,20.34 57.14,19.44 v57.14,19.12
  Bottom 0.254: v43.17,33.73 43.17,23.88 48.25,18.8 56.83,18.8 v57.14,19.12
EC_SEL1  (via drill 0.25 pad 0.7)
  Top 0.254: U10.13 44.44,37.85 43.81,37.22 v43.81,34.68 | U30M.10 55.28,20.34 v55.55,20.07
  Bottom 0.254: v43.81,34.68 43.81,24.2 47.94,20.07 v55.55,20.07
GND  (via drill 0.25 pad 0.7)
  Top 0.508: U62.3 71.11,69.92
  other vias: 41.9,48.97 44.6,52.3 41.9,52.3 48.41,44.52 47.14,52.3 40.47,44.52 46.98,48.97 44.6,48.97 88.26,31.34 86.67,31.34 89.84,31.34 89.84,33.41 88.26,33.41 86.67,33.41 38.97,48.02 49.47,48.02 38.97,43.52 40.97,42.02 43.97,42.02 9.33,11.54 45.49,11.62 86.03,1.34 58.35,9.87 108.51,10.5 72.16,9.71 36.12,10.19 22.44,9.71 62.7,83.1 60,84.21 57.3,83.1 65.87,58.01 71.43,56.27 88.26,1.34 83.81,1.34 92.38,1.34 95.24,1.34 98.1,1.34 81.69,11.62 74.29,69.92 71.11,69.76 56.03,21.98 56.51,20.87
  pour Top (rank 6): 120,0 0,0 0,72.5 3,72.5 3,79.5 0,79.5 0,87.5 120,87.5
  pour Bottom (rank 2): 120,0 0,0 0,72.5 3,72.5 3,79.5 0,79.5 0,87.55 120,87.55
  pour Route2 (rank 2): 120,0 0,0 0,72.5 3,72.5 3,79.5 0,79.5 0,87.5 120,87.5
LED_GRN
  Top 0.254: U10.93 33.37,44.56 32.06,43.25 32.06,34.04 30.16,32.14 GRN.1
  Top 0.762: GRN.1 R11L.1
LED_RED
  Top 0.254: U10.92 32.6,45.06 31.11,43.57 31.11,36.27 30.16,35.31 RED.1
  Top 0.762: R10L.1 RED.1
LEVEL0
  Top 0.254: U10.3 39.44,38.25 38.73,37.53 38.73,29.91 40.63,28.01 65.72,28.01 78.73,14.99 78.73,4.51 79.37,3.88 86.67,3.88 87.77,4.97 J50.4
  Bottom 1.016: Z51.2 88.26,5.61 J50.4
LEVEL1
  Top 0.254: U10.98 35.31,42.06 34.92,41.66 34.92,21.98 42.22,14.68 42.22,5.79 44.12,3.88 50.48,3.88 51.57,4.97 J51.4
  Bottom 1.016: Z54.2 52.06,5.61 J51.4
LEVEL2
  Top 0.254: U10.95 34.91,43.56 33.49,42.14 33.49,26.74 30.95,24.2 17.45,24.2 7.93,14.68 7.93,4.51 8.56,3.88 14.44,3.88 15.38,4.82 J52.4
  Bottom 1.016: Z57.2 15.87,5.61 J52.4
LIGHT_OUT  (via drill 0.25 pad 0.7)
  Top 0.254: U10.36 54.4,46.06 58.09,49.76 58.09,80.08 v63.68,85.66
  Bottom 0.508: U61.3 62.32,86.04 R60L.1
  Bottom 0.762: R60L.1 v63.68,85.66
LIGHT_SD  (via drill 0.25 pad 0.7)
  Top 0.254: U10.37 54.1,46.56 56.19,48.65 56.19,80.08 v59.05,82.94
  Bottom 0.254: 59.05,83.59 U61.6
  Bottom 0.508: v59.05,82.94 59.05,83.59
MISO0  (via drill 0.25 pad 0.7)
  Top 0.254: J20D.3 23.8,42.61 23.8,40.39 24.12,40.08 26.34,40.08 27.3,41.03 27.3,49.6 29.26,51.56 U10.79 38.36,51.56 v39.05,50.87
  Top 0.508: U11.19 v62.7,42.61 | U12.4 67.46,57.25 v67.46,58.01
  Bottom 0.254: v39.05,50.87 39.36,50.55 61.43,50.55 63.49,48.49 63.49,43.41 v62.7,42.61 67.62,42.61 68.57,43.57 68.57,57.22 67.78,58.01 v67.46,58.01
MOSI0  (via drill 0.25 pad 0.7)
  Top 0.254: J20D.4 18.73,42.61 18.73,40.39 19.68,39.44 26.5,39.44 27.93,40.87 27.93,49.44 29.55,51.06 U10.80 37.59,51.06 38.41,50.23 v38.41,49.92
  Top 0.305: U11.17 68.25,45.16 68.89,45.79 68.89,56.9 69.2,57.22 U12.3
  Top 0.508: U11.17 v62.7,45.16
  Bottom 0.254: v38.41,49.92 60.95,49.92 62.7,48.17 v62.7,45.16
N$1  (via drill 0.25 pad 0.7)
  Top 0.254: U10.49 51.21,52.56 v50.79,52.14
  Bottom 0.762: C10V.1 v50.79,52.14
N$2
  Bottom 0.762: J60.1 7.85,28.06 R60F.2
  Bottom 1.016: Z60.2 6.09,28.15 J60.1
N$3  (via drill 0.25 pad 0.7)
  Top 0.254: R62F.2 9.68,27.88 R60F.1
  Bottom 0.762: C60F.1 R60F.1
  other vias: 9.54,28.01
N$4  (via drill 0.25 pad 0.7)
  Top 0.254: U10.73 v39.44,53.31
  Bottom 0.762: C11V.1 39.68,53.55 v39.44,53.31
N$5
  Top 0.305: U31A.5 57.64,11.52 57.94,11.82 R32I.2
  Top 0.762: R32I.2 R33I.1 C30I1.2
N$6
  Top 0.305: U32A.5 21.45,11.52 21.74,11.82 R34I.2
  Top 0.762: R34I.2 R35I.1 C32I.2
N$7
  Top 0.508: R61A.2 14.25,25.09 U60A.4 15.71,26.11 R60A.1
N$8
  Top 0.508: U60A.3 10.12,26.11 R62F.1
N$9
  Top 0.305: U41A.5 68.25,11.52 R41I.2
  Top 0.762: C41I.2 R41I.2
N$10
  Bottom 0.508: D50.1- 81.75,6.09 J50.1
  Bottom 1.016: R50P.2 81.75,6.12 J50.1
N$11
  Top 0.762: T50P.3 83.81,6.15 J50.2
  Bottom 0.508: D50.2 82.24,2.3 82.86,2.93 82.86,3.56 83.77,4.47 Z52.2
  Bottom 1.016: Z52.2 83.81,6.05 J50.2
N$12
  Top 0.762: R03L.2 9V.A
N$13
  Top 0.762: LD51R.A R51L.2
N$14
  Top 0.762: T51P.3 47.62,6.15 J51.2
  Bottom 0.508: D51.2 46.04,2.3 46.66,2.93 46.66,3.52 Z55.2
  Bottom 1.016: Z55.2 47.62,6.05 J51.2
N$15
  Bottom 0.762: R50S.2 85.72,6.15 J50.3
  Bottom 1.016: Z50.2 86.03,5.83 J50.3
N$16
  Bottom 0.508: D51.1- 45.57,4.52 J51.1
  Bottom 0.762: R51P.2 45.57,7.53
  Bottom 1.016: 45.57,7.53 J51.1
N$17
  Top 0.305: U42A.5 32.05,11.52 R42I.2
  Top 0.762: C42I.2 R42I.2
N$18
  Top 0.762: T52P.3 11.42,6.15 J52.2
  Bottom 0.508: D52.2 9.85,2.3 10.47,2.93 10.47,3.52 Z58.2
  Bottom 1.016: Z58.2 11.38,4.52 J52.2
N$19
  Top 0.305: R30I.2 | R31I.1 | U30A.5 93.84,11.52 94.13,11.82 R30I.2
  Top 0.762: R30I.2 R31I.1 | C30I.2 R31I.1
N$20
  Top 0.305: U40A.5 104.44,11.52 R40I.2
  Top 0.762: C40I.2 R40I.2
N$21
  Top 0.762: SP20.+ 99.6,82.85 100.05,83.3 J20S.1
N$22
  Top 0.762: J20S.2 102.5,81.3 99.37,78.17 99.37,71.83 96.62,69.07 SP20.-
N$23
  Bottom 0.762: R51S.2 49.52,6.15 J51.3
  Bottom 1.016: Z53.2 49.57,4.47 J51.3
N$24
  Top 0.762: LD52R.A R52L.2
N$25
  Bottom 0.508: D52.1- 9.36,6.09 J52.1
  Bottom 0.762: 9.36,6.12 J52.1
  Bottom 1.016: R52P.2 9.36,6.12
N$27
  Bottom 0.762: R52S.2 13.33,6.1
  Bottom 1.016: Z56.2 13.33,4.79 13.33,6.1 J52.3
N$28
  Top 0.762: R02L.2 3V3.A
N$29
  Top 0.762: R01L.2 VIN.A
N$38
  Top 0.762: LD11-G.A R11L.2
N$39
  Top 0.762: R10L.2 LD10-R.A
N$70
  Top 0.762: LD50R.A R50L.2
N$152
  Top 0.762: RX-BUS.A R13L.2
N$153
  Top 0.762: TX-BUS.A R12L.2
NTC0  (via drill 0.25 pad 0.7)
  Top 0.254: U10.33 55.28,44.56 55.71,45 v56.98,45
  Route15 0.254: v56.98,45 56.98,24.36 66.83,14.52 87.15,14.52 92.07,9.6 92.07,6.28 J30.1
  Bottom 0.762: R30C.2 92.23,6.12
  Bottom 1.016: Z30.2 92.38,5.96 J30.1 92.23,6.12
NTC1  (via drill 0.25 pad 0.7)
  Top 0.254: U10.29 54.55,42.56 v54.6,42.61
  Route15 0.254: J31.1 55.87,6.28 55.87,10.87 55.55,11.18 55.55,13.72 55.87,14.04 55.87,15.95 54.6,17.21 v54.6,42.61
  Bottom 0.762: R31C.2 56.03,6.12
  Bottom 1.016: Z33.2 56.19,5.96 J31.1 56.03,6.12
NTC2  (via drill 0.25 pad 0.7)
  Top 0.254: U10.17 46.44,36.04 v46.19,35.79
  Route15 0.254: J32.1 19.85,9.74 18.09,11.5 18.09,19.76 20.95,22.61 34.92,22.61 46.19,33.88 v46.19,35.79
  Bottom 0.762: R32C.2 19.84,6.12
  Bottom 1.016: Z36.2 19.99,5.96 J32.1 19.84,6.12
PAR_OUT  (via drill 0.25 pad 0.7)
  Top 0.254: U10.15 45.44,37.58 v44.6,36.74
  Top 0.305: 12.03,24.65 12.85,25.47 12.85,27.53 12.38,28.01 U60A.1
  Top 0.508: R61A.1 12.03,24.65
  Bottom 0.254: v44.6,36.74 33.97,26.11 13.62,26.11 R61A.1
  other vias: 12.03,24.52
PH0  (via drill 0.25 pad 0.7)
  Top 0.254: U10.34 54.98,45.06 55.71,45.79 v57.78,45.79
  Top 0.305: U40A.6 U40A.7 106.66,10.22 v106.99,10.55
  Route15 0.254: v106.99,10.55 106.04,9.6 93.97,9.6 87.31,16.26 66.03,16.26 57.78,24.52 v57.78,45.79
PH0_IN
  Top 0.457: J40.PIN 107.94,8.01 107.47,8.48 104.61,8.48 104.29,8.8 R40I.1
PH1  (via drill 0.25 pad 0.7)
  Top 0.254: U10.31 55.24,43.56 v55.4,43.41
  Top 0.305: U41A.6 U41A.7 70.47,10.22 v70.8,10.55
  Route15 0.254: v70.8,10.55 68.73,10.55 55.4,23.88 v55.4,43.41
PH1_IN
  Top 0.457: R41I.1 68.09,8.8 68.41,8.48 71.27,8.48 71.75,8.01 J41.PIN
PH2  (via drill 0.25 pad 0.7)
  Top 0.254: U10.18 46.94,35.35 v46.98,35.31
  Top 0.305: U42A.6 U42A.7 34.59,10.22 v34.92,10.55
  Route15 0.254: v34.92,10.55 34.92,16.58 46.98,28.64 v46.98,35.31
PH2_IN
  Top 0.457: R42I.1 31.9,8.8 32.22,8.48 35.08,8.48 35.55,8.01 J42.PIN
PRESSURE
  Top 0.254: U62.4 71.75,68.65 59.68,56.59 59.68,50.55 54.69,45.56 U10.35
PUMP0
  Top 0.254: R50L.1 85.53,12.58 86.03,13.09 86.03,14.99 85.56,15.47 78.89,15.47 65.72,28.64 40.95,28.64 39.36,30.23 39.36,37.22 40.44,38.3 U10.5
  Top 0.762: T50P.1 R50L.1
PUMP1
  Top 0.254: R51L.1 49.34,12.58 50.79,14.04 50.79,20.07 50.16,20.71 38.41,20.71 37.14,21.98 37.14,39.76 37.77,40.39 39.68,40.39 39.94,40.13 U10.4
  Top 0.762: T51P.1 R51L.1
PUMP2
  Top 0.254: R52L.1 13.14,12.58 14.28,13.72 14.28,17.85 19.99,23.56 31.11,23.56 33.97,26.42 33.97,41.98 35.05,43.06 U10.96
  Top 0.762: T52P.1 R52L.1
REF_EC  (via drill 0.25 pad 0.7)
  Top 0.254: U10.38 53.02,47.06 v53.33,47.38
  Route15 0.254: v85.08,22.93 92.23,22.93 v93.34,24.04
  Bottom 0.254: v53.33,47.38 53.65,47.06 58.09,47.06 58.73,46.42 58.73,34.04 69.84,22.93 v85.08,22.93 | 93.45,24.16 v93.34,24.04
  Bottom 0.508: U30R.3 93.45,24.16
REF_PH  (via drill 0.25 pad 0.7)
  Top 0.254: U10.39 51.29,47.56 v50.79,47.06
  Bottom 0.254: v50.79,47.06 51.43,47.06 52.54,48.17 58.09,48.17 59.68,46.58 59.68,35.31 70.84,24.16 U40R.3
RXD_232
  Top 0.254: J10S.1 6.18,61.51 8.56,63.89 39.05,63.89 41.44,61.49 U10.69
  Bottom 1.016: Z11S.2 5.96,60.71 J10S.1
RXD_485  (via drill 0.25 pad 0.7)
  Top 0.254: U10.24 49.94,38.23 51.43,36.74 95.72,36.74 v97.15,35.31 | 98.73,35.37 U20.1
  Top 0.508: U20.1 v97.15,35.31
  Top 0.762: RX-BUS.C 118.61,49.47 v118.42,49.28
  Route2 0.254: v118.42,49.28 111.12,49.28 v97.15,35.31
SCK0  (via drill 0.25 pad 0.7)
  Top 0.254: J20D.1 26.66,42.93 26.66,49.76 28.96,52.06 U10.78 39.44,52.06 v39.68,51.82
  Top 0.305: U11.20 65.87,41.34 66.19,41.66 66.19,43.57 v65.87,43.88 68.57,43.88 70.29,45.6 U12.1
  Top 0.508: U11.18 v65.87,43.88
  Bottom 0.254: v39.68,51.82 40.31,51.19 61.91,51.19 64.13,48.97 64.13,45.63 v65.87,43.88
SCL0
  Top 0.254: U10.47 53.86,51.56 54.6,52.3 54.6,82.3 51.74,85.16 38.41,85.16 37.14,83.89 U60.3
  Bottom 0.762: R10I.2 U60.3
SDA0
  Top 0.254: U10.48 53.57,52.06 53.97,52.46 53.97,81.98 51.43,84.53 40.63,84.53 39.68,83.57 U60.4
  Bottom 0.762: R11I.2 U60.4
SWCLK
  Top 0.254: J10P.2 7.3,49.92 11.1,53.73 11.1,59.76 13.33,61.98 33.97,61.98 35.55,60.4 35.55,53.41 35.9,53.06 U10.76
  Bottom 1.016: Z112P.2 J10P.2
SWDIO
  Top 0.254: J10P.1 7.39,51.92 10.15,54.68 10.15,60.08 13.01,62.94 35.55,62.94 39.94,58.55 U10.72
  Bottom 1.016: Z10P.2 5.96,52.14 J10P.1
TXD_232
  Top 0.254: J10S.2 5.07,58.49 4.76,58.81 4.76,61.66 7.93,64.84 39.05,64.84 41.94,61.94 U10.68
  Bottom 1.016: Z10S.2 J10S.2
TXD_485  (via drill 0.25 pad 0.7)
  Top 0.254: U10.23 49.44,37.93 51.43,35.95 94.92,35.95 97.15,33.73 v97.15,31.5
  Top 0.508: U20.4 v97.15,31.5
  Top 0.762: TX-BUS.C 118.61,46.3 v118.42,46.11
  Route2 0.254: v118.42,46.11 110.48,46.11 97.15,32.77 v97.15,31.5
V0  (via drill 0.25 pad 0.7)
  Top 0.305: R30I.1 94.13,14.36 93.02,13.25 93.02,12.93 92.73,12.93 C30A.1 92.07,12.9 | U30A.8 93.14,9.15 v93.34,8.96
  Top 0.762: L30A.2 92.07,12.9 C30A.1 | C30A.1 | R30B.1 v101.3,10.54
  Route15 0.305: C30A.1 95.05,10.55 v101.3,10.55 v101.3,10.54
  Bottom 0.508: R30C.1 93.15,9.46 93.34,9.28 v93.34,8.96
  Bottom 0.762: R30C.1 92.22,12.43 C30A.1
  other vias: 92.7,12.9
V1  (via drill 0.25 pad 0.7)
  Top 0.305: C31A.1 56.51,12.93 57.94,14.36 R32I.1 | 56.95,12.46 C31A.1 56.32,12.9 56.19,12.77 | U31A.8 56.95,9.15 v57.14,8.96
  Top 0.762: L31A.2 C31A.1 | R32B.1 v65.11,10.54
  Route15 0.254: C31A.1 58.86,10.54 v65.11,10.54
  Bottom 0.508: R31C.1 56.96,9.46 57.14,9.28 v57.14,8.96
  Bottom 0.762: R31C.1 56.03,12.43 C31A.1
  other vias: 56.51,12.9
V2  (via drill 0.25 pad 0.7)
  Top 0.305: C32A.1 20.31,12.93 21.58,14.2 21.58,14.38 R34I.1 | C32A.1 20.18,12.9 19.99,13.09 | U32A.8 20.75,9.13 v20.95,8.93
  Top 0.762: L32A.2 C32A.1 | R34B.1 28.14,10.52 v28.91,10.52
  Route15 0.254: C32A.1 22.69,10.52 v28.91,10.52
  Bottom 0.508: R32C.1 20.76,9.46 20.95,9.28 v20.95,8.94 v20.95,8.93
  Bottom 0.762: R32C.1 19.83,12.43 C32A.1
  other vias: 20.31,12.9
V3  (via drill 0.25 pad 0.7)
  Top 0.254: 105.72,12.93 107.15,14.36 R40B.1 | 105.84,12.62 105.84,12.78 C40A.2
  Top 0.305: 105.72,12.93 C40A.2 105.72,13.09 | U40A.8 107.6,9.57 v107.62,9.6
  Top 0.762: L40A.2 C40A.2
  Bottom 0.305: v107.62,9.6 106.35,9.6 105.72,10.23 C40A.2
  other vias: 105.72,12.9
V4  (via drill 0.25 pad 0.7)
  Top 0.254: 69.65,12.78 69.65,13.05 70.95,14.36 R42B.1 | v69.53,12.93 C41A.2
  Top 0.305: 69.65,12.78 C41A.2 | U41A.8 70.5,9.57 v70.8,9.28
  Top 0.762: C41A.2 L41A.2
  Bottom 0.305: v70.8,9.28 70.16,9.28 69.53,9.91 v69.53,12.93
V5  (via drill 0.25 pad 0.7)
  Top 0.305: C42A.2 33.33,12.93 34.6,14.2 34.6,14.38 R44B.1 | U42A.8 34.3,9.57 v34.6,9.28
  Top 0.762: L42A.2 C42A.2
  Bottom 0.305: v34.6,9.28 33.97,9.28 33.33,9.91 C42A.2
  other vias: 33.33,12.9
VBAT
  Top 0.457: U11.16 62.22,46.42 61.59,47.06 61.59,56.27 67.08,61.76 BAT10.1.+
VBIAS0  (via drill 0.25 pad 0.7)  (2 unrouted)
  Top 0.305: U40A.2 U40A.1 110.04,4.63 J40.GND5
  Bottom 0.254: v104.13,4.51 104.13,3.04 J40.GND4 104.13,2.92 v104.13,1.34 107.55,1.34 J40.GND3 111.36,1.73 v111.75,1.34 111.75,2.93 111.74,2.93 J40.GND5 111.75,3.04 v111.75,4.51
VBIAS1  (via drill 0.25 pad 0.7)  (2 unrouted)
  Top 0.305: U41A.2 U41A.1 73.85,4.63 J41.GND2
  Bottom 0.254: v75.56,1.34 v67.94,1.34 v67.94,4.51 67.94,3.04 J41.GND1 | v75.56,4.51 75.56,3.04 J41.GND2 75.56,2.92 v75.56,1.34 | J41.GND3 75.17,1.73 v75.56,1.34
VBIAS2  (via drill 0.25 pad 0.7)  (2 unrouted)
  Top 0.305: U42A.2 U42A.1 37.65,5.27 39.05,3.88 39.05,3.24 J42.GND2 | v31.74,4.51 31.74,3.04 J42.GND1
  Top 0.762: v31.74,1.34 31.74,2.92 J42.GND1
  Bottom 0.305: J42.GND1 31.8,1.91 32.06,1.66 35.48,1.66 J42.GND3 38.8,1.73 39.36,2.29 | 39.36,2.29 39.36,2.92 J42.GND2 39.36,3.04 v39.36,4.51 | v39.36,1.34 39.36,2.29
VCC  (via drill 0.25 pad 0.7)
  Top 0.762: L42A.1 v31.9,15.31 | L41A.1 v68.1,15.31 | L40A.1 v104.29,15.31
  Route2 0.508: v104.29,15.31 103.18,16.42 90.48,16.42 | 90.48,16.42 69.21,16.42 v68.1,15.31 66.98,16.42 33.01,16.42 v31.9,15.31 | v90.64,19.76 90.64,16.58 90.48,16.42
  Bottom 0.508: U40R.5 C41R.1
  Bottom 0.762: C41R.1 90.71,19.82 v90.64,19.76
VCC_VREF  (via drill 0.25 pad 0.7)
  Top 0.508: U62.2 71.3,71.19 C62D.1 | C63D.1 13.67,28.3 13.96,28.01 U60A.5
  Top 0.762: L30M.1 v59.84,23.56 | C62D.1 70.19,71.38 v70.16,71.35
  Route2 0.508: v70.16,71.35 50,71.35 45.71,67.06 45.71,45.79 46.66,44.84 v46.66,42.93 46.66,38.49 59.84,25.31 v59.84,23.56 19.7,23.56 C63D.1
  Bottom 0.508: U10R.5 46.66,45.48 | 46.66,45.48 47.49,45.48 C11R.1 | L10R.1 46.69,45.45 46.66,45.48
  Bottom 0.762: L10R.1 46.66,43.89 v46.66,42.93
  other vias: 13.67,29.6
VCCA  (via drill 0.25 pad 0.7)
  Top 0.508: L31A.1
  Top 0.762: L32A.1 v18.88,15.31 | L30A.1 v91.27,15.47 | v55.08,15.31 L31A.1
  Bottom 0.508: 97.15,22.3 97.23,22.3 U30R.5 97.22,22.21 C31R.1 97.22,19.66 93.02,15.47 v91.27,15.47 90.32,14.52 55.71,14.52 55.08,15.15 v55.08,15.31 54.28,14.52 19.68,14.52 v18.88,15.31
VDD_3V3  (via drill 0.25 pad 0.7)
  Top 0.254: 36.69,41.03 U10.100 37.85,41.06 v37.98,41.19 | v37.14,77.86 | v39.68,77.86 | U10.75 38.44,53.35 v38.41,53.31 | U10.50 51.14,53.06 v50.79,53.41 | U10.28 50.87,42.06 v50.79,42.14 | U10.6 v40.94,40.7 v40.95,40.71 | U10.11 43.44,40.66 v43.49,40.71 | U10.19 47.44,40.53 v47.62,40.71 | U10.22 48.94,40.45 v49.2,40.71 | v103.81,35.63 103.81,35.38 U20.8
  Top 0.508: U11.4 75.59,45.16 C10C.1 | U12.6 66,55.32 C10E.1
  Top 0.762: 75.59,45.16 v75.72,45.28 | R12L.1 v113.5,47.06 | R13L.1 v113.5,50.24 v113.5,50.23 | R02L.1 114.11,63.54 v114.13,63.57 | C20D.1 v103.81,35.63 | C10E.1 v65.87,54.52
  Bottom 0.254: v49.52,9.12
  Bottom 0.508: U61.4 57.68,86.04 C61D.1 | C30R.1 97.27,25.54 U30R.4 98.38,24.16 v98.42,24.2 | v91.75,24.2 91.71,24.16 U40R.4 C40R.1 | C10R.1 41.39,47.38 U10R.3 U10R.4 | v13.33,9.12 R52S.1
  Bottom 0.762: C10R.1 41.29,47.22 v41.74,47.22 | C60D.1 32.38,80.39 32.06,80.72 U60.1 | C61D.1 57.27,85.64 v56.35,85.64 | C14D.1 38.09,53.63 v38.41,53.31 | C12D.1 51.11,41.82 v50.79,42.14 | C10B.1 v40.95,40.71 | C10D.1 v43.49,40.71 | C11D.1 v47.62,40.71 | C10A.1 v49.2,40.71 | C15D.1 37.96,41.17 v37.98,41.19 | C13D.1 50.95,53.57 v50.79,53.41 | R10I.1 v37.14,77.86 | R11I.1 v39.68,77.86 | R51S.1 v49.52,9.12 | R50S.1 v85.72,9.12
  Bottom 1.27: J20D.9 C21D.1
  pour Route15 (rank 2): 120,0 0,0 0,72.5 3,72.5 3,79.5 0,79.5 0,87.5 120,87.5
VDD_9V  (via drill 0.25 pad 0.7)
  Top 0.305: R03L.1 106.67,65.79 103.5,62.62 DC02.3
  Route2 0.762: v107.62,11.82 83.81,11.82 v81.75,9.75 79.69,11.82 47.61,11.82 v45.54,9.75 43.49,11.81 43.49,11.82 11.41,11.82 v9.35,9.75
  Bottom 0.254: R50P.1 81.42,9.74
  Bottom 0.762: R52P.1 v9.35,9.75 | R51P.1 v45.54,9.75 | 81.74,9.75 R50P.1 v81.75,9.75 | v107.62,11.82 113.02,17.21 113.02,45.16 103.5,54.68 DC02.3
VDD_24V  (via drill 0.25 pad 0.7)
  Top 0.254: J21B.A5 109.01,38.69 109.21,38.49 109.23,38.49 109.53,38.19 | J21B.A8 109.01,40.19 109.21,40.39 109.23,40.39 109.53,40.69 | J20B.A5 109.01,26.62 109.21,26.42 109.23,26.42 109.53,26.12 | J20B.A8 109.03,28.12 109.53,28.62
  Top 0.305: J21B.A9 109.53,40.69 109.64,40.69 J21B.B4 | J21B.A4 109.53,38.19 109.64,38.19 J21B.B9 | J20B.A9 109.53,28.62 109.64,28.62 J20B.B4 | J20B.A4 109.53,26.12 109.64,26.12 J20B.B9
  Top 0.762: R01L.1 114.11,58.52 v114.13,58.49
  Route15 0.305: v114.13,58.49 111.91,58.49
  Bottom 1.524: C01I.1 108.75,68.48 DC01.1 | C02I.1 108.75,60.22 DC02.1
  pour Route15 (no thermals): 108.26,25.47 108.26,69.6 112.7,69.6 112.7,25.47
VREF1  (via drill 0.25 pad 0.7)
  Top 0.254: U10.21 48.44,41.16 47.94,41.66 46.03,41.66 45.08,42.61 v45.08,43.25
  Bottom 0.508: L10R.2 45.08,43.88
  Bottom 0.762: C12R.2 L10R.2 | 45.08,43.88 v45.08,43.25
VX
  Top 0.254: U30M.6 55.28,22.34 55.74,22.8 C30M.1 | U30M.5 57.73,22.34 57.27,22.8 L30M.2
  Top 0.762: C30M.1 L30M.2

## Text on the board
Top: 1
Route2: 2
Route15: 3
Bottom: 4
tPlace: SERIAL | DEBUG | SunWeb MASTER | - PAR + | 190730-v1.1